# EAGLE design XBee4 (EAGLE 6.4)
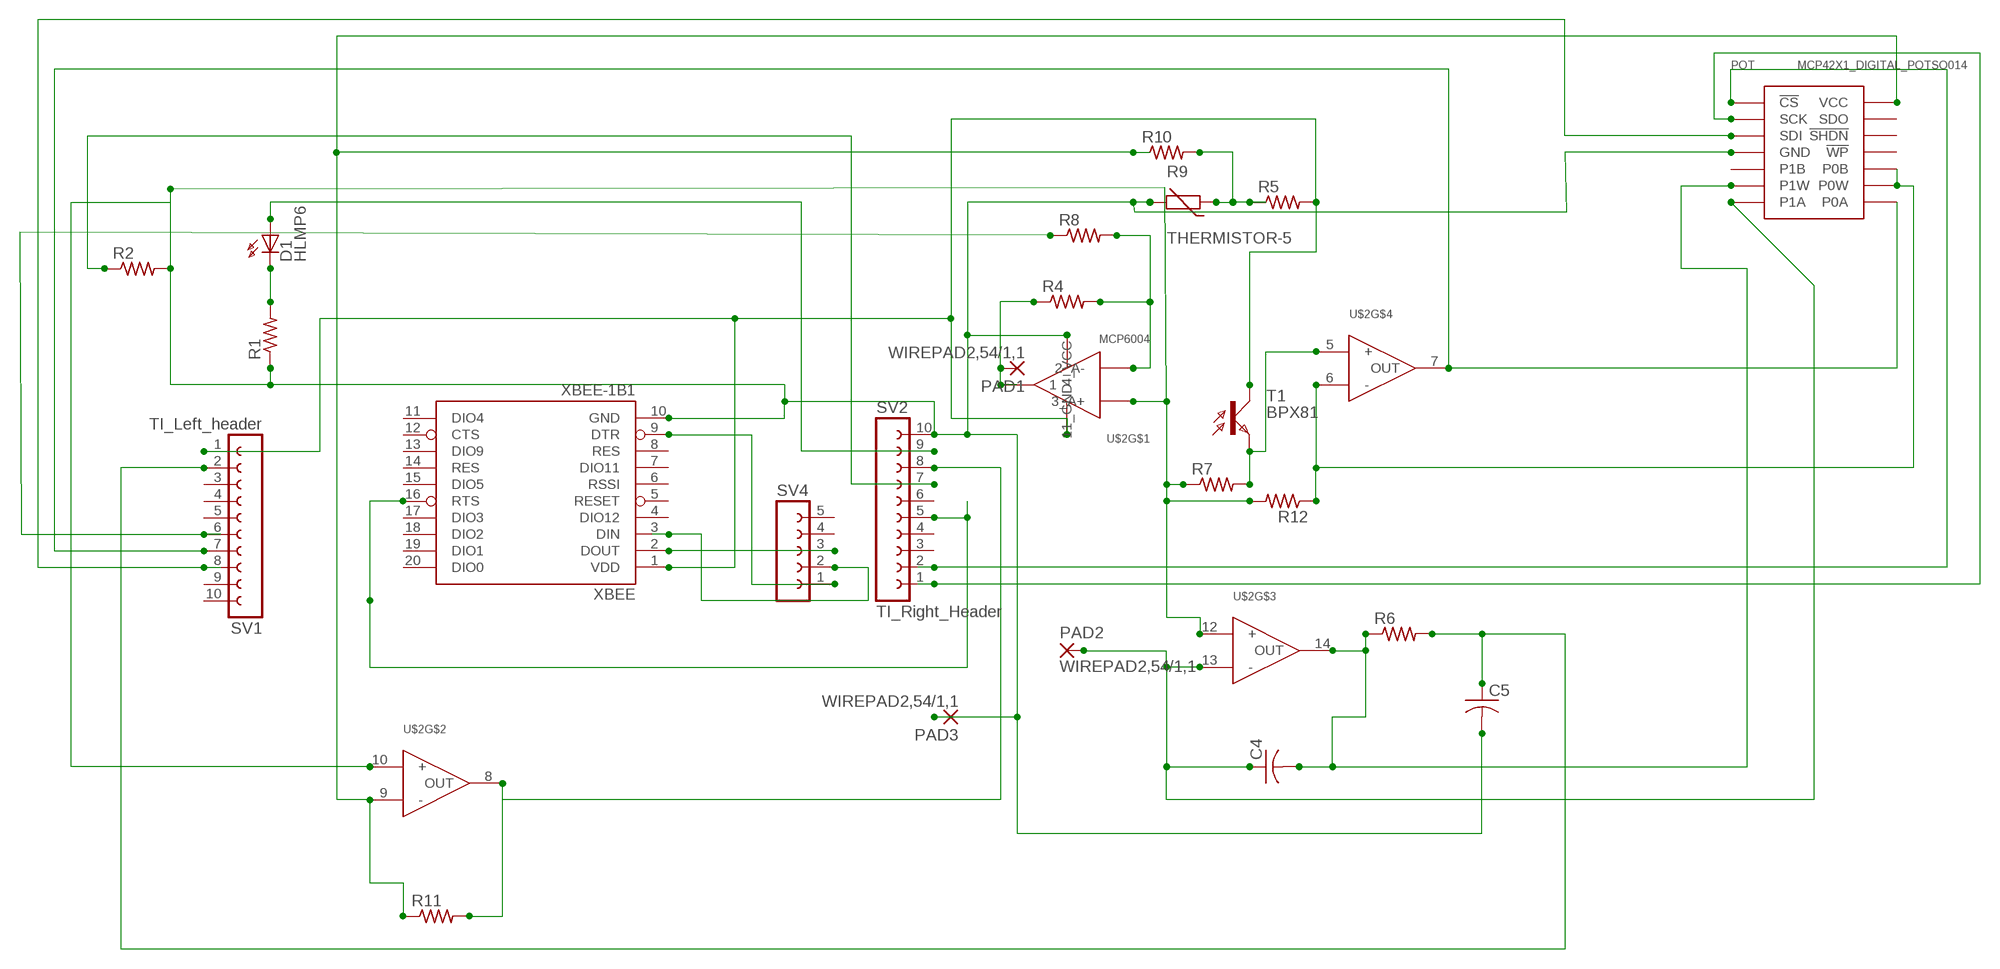
[diagram p0: schematic, sheet 1]

## Parts
C4  C-USC0603  [C0603]
C5  C-USC0603  [C0603]
D1  HLMP6  [HLMP6]
PAD1  WIREPAD2,54/1,1  [2,54/1,1]
PAD2  WIREPAD2,54/1,1  [2,54/1,1]
PAD3  WIREPAD2,54/1,1  [2,54/1,1]
POT  MCP42X1_DIGITAL_POTSO014  [SO014]
R1  R-US_R0603  [R0603]
R2  R-US_R0603  [R0603]
R4  R-US_R0603  [R0603]
R5  R-US_R0603  [R0603]
R6  R-US_R0603  [R0603]
R7  R-US_R0603  [R0603]
R8  R-US_R0603  [R0603]
R9  THERMISTOR-5  [R-5]
R10  R-US_R0603  [R0603]
R11  R-US_R0603  [R0603]
R12  R-US_R0603  [R0603]
SV1  TI_Left_header  FE10-1  [FE10]
SV2  TI_Right_Header  FE10-1  [FE10]
SV4  FE05-1  [FE05-1]
T1  BPX81  [BPX81]
U$2  MCP6004  [SO014]
XBEE  XBEE-1B1  [XBEE-1]

## Nets
GND: C5.2 PAD3.1(P) POT.P4(GND) R1.1 R2.2 R7.1 R9.2 R12.2 SV2.10 U$2.3(3_A+) U$2.10(+) U$2.11(11_GND) U$2.12(+) XBEE.10(GND)
N$1: D1.K R1.2
N$2: R7.2 T1.E U$2.5(+)
N$3: SV4.3 XBEE.2(DOUT)
N$4: SV4.1 XBEE.9(DTR)
N$5: SV4.2 XBEE.3(DIN)
N$7: POT.P9(P0W) POT.P10(P0B) R12.1 U$2.6(-)
N$11: R2.1 SV2.7
N$12: R11.2 SV2.8 U$2.8(OUT)
N$13: POT.P14(VCC) R10.1 R11.1 U$2.9(-)
N$14: PAD1.1(P) R4.1 U$2.1
N$15: D1.A SV2.9
N$17: C4.1 PAD2.1(P) POT.P7(P1A) U$2.13(-)
N$18: C4.2 POT.P6(P1W) R6.1 U$2.14(OUT)
N$19: C5.1 R6.2 SV1.2
N$20: R5.1 R9.1 R10.2
N$21: R4.2 R8.2 U$2.2(2_A-)
N$22: SV2.5 XBEE.16(RTS)
POT_CS: POT.P1(!CS) SV2.2
POT_SCK: POT.P2(SCK) SV2.1
POT_SDI: POT.P3(SDI) SV1.8
PULSE: R8.1 SV1.6
TI_PN7_READ: POT.P8(P0A) SV1.7 U$2.7(OUT)
VCC: R5.2 SV1.1 T1.C U$2.4(4_VCC) XBEE.1(VDD)
Unconnected: POT.P5(P1B) POT.P11(!WP) POT.P12(!SHDN) POT.P13(SDO) SV1.3 SV1.4 SV1.5 SV1.9 SV1.10 SV2.3 SV2.4 SV2.6 SV4.4 SV4.5 XBEE.4(DIO12) XBEE.5(RESET) XBEE.6(RSSI) XBEE.7(DIO11) XBEE.8(RES) XBEE.11(DIO4) XBEE.12(CTS) XBEE.13(DIO9) XBEE.14(RES) XBEE.15(DIO5) XBEE.17(DIO3) XBEE.18(DIO2) XBEE.19(DIO1) XBEE.20(DIO0)

## Library data of the parts
C4 C5 = rcl:C-US: CAPACITOR, American symbol
D1 = display-hp:HLMP6: LED 2mm horizontal; MF: AGILENT TECHNOLOGIES; MPN: HLMP-6500; OC_FARNELL: 1652490; OC_NEWARK: 40K0088
PAD1-PAD3 = wirepad:WIREPAD: Wire PAD connect wire on PCB
POT = JackLibrary:MCP42X1_DIGITAL_POT
R1 R2 R4-R8 R10-R12 = resistor:R-US_: RESISTOR, American symbol
R9 = varistor:THERMISTOR: THERMISTOR
SV1 SV2 = con-lsta:FE10-1: FEMALE HEADER; OC_FARNELL: unknown; OC_NEWARK: unknown
SV4 = con-lsta:FE05-1: FEMALE HEADER; OC_FARNELL: unknown; OC_NEWARK: unknown
T1 = opto-trans-siemens:BPX81: PHOTO TRANSISTOR; OC_FARNELL: unknown; OC_NEWARK: unknown
U$2 = SparkFun-AnalogIC:MCP6004: 14SOIC quad op amp, R2R, low power
XBEE = SparkFun-RF:XBEE-1: Xbee module footprints SMT header is CONN-09042.

## Board
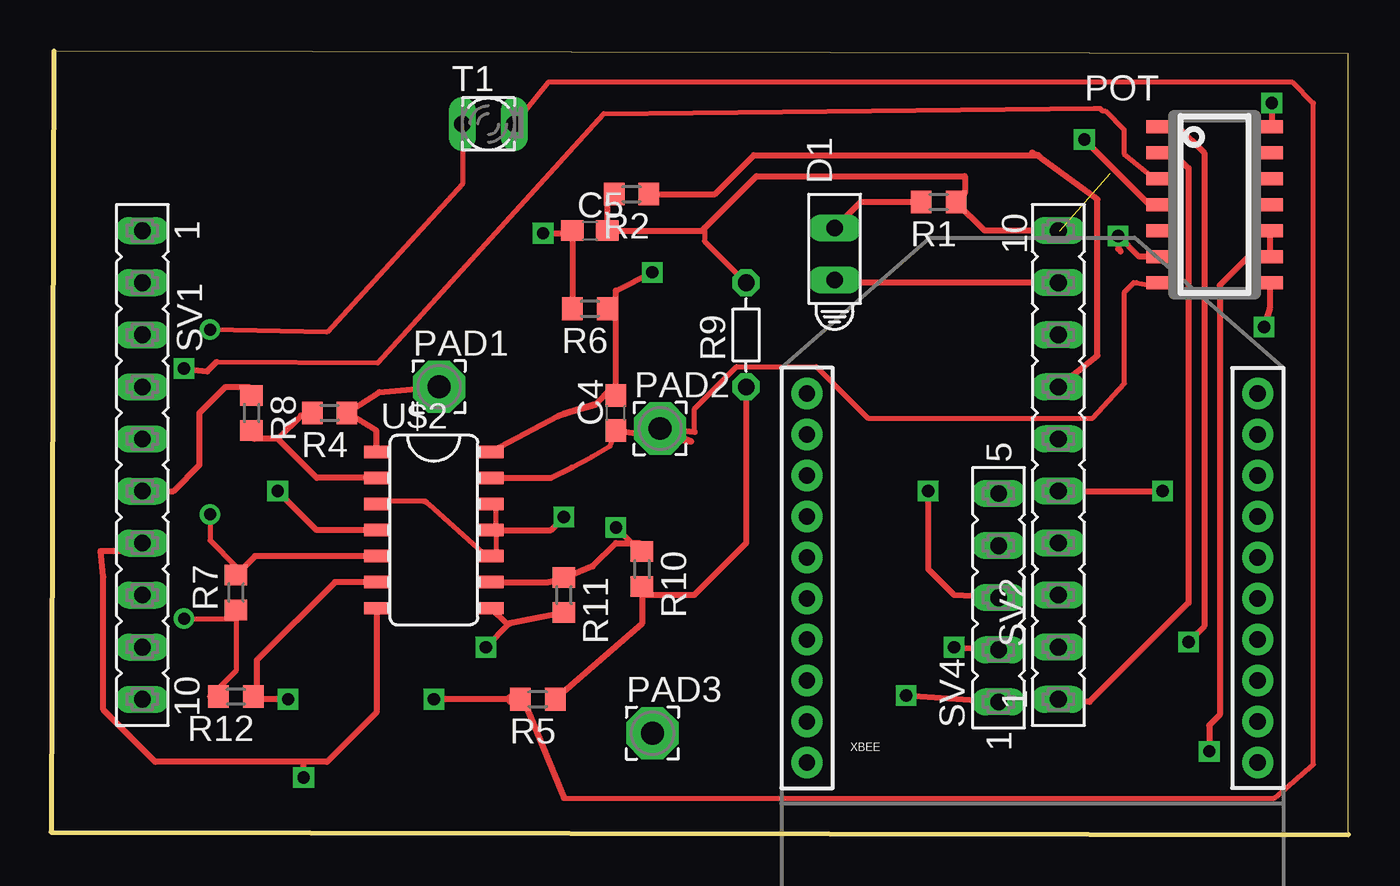
[diagram p1: board, top side]
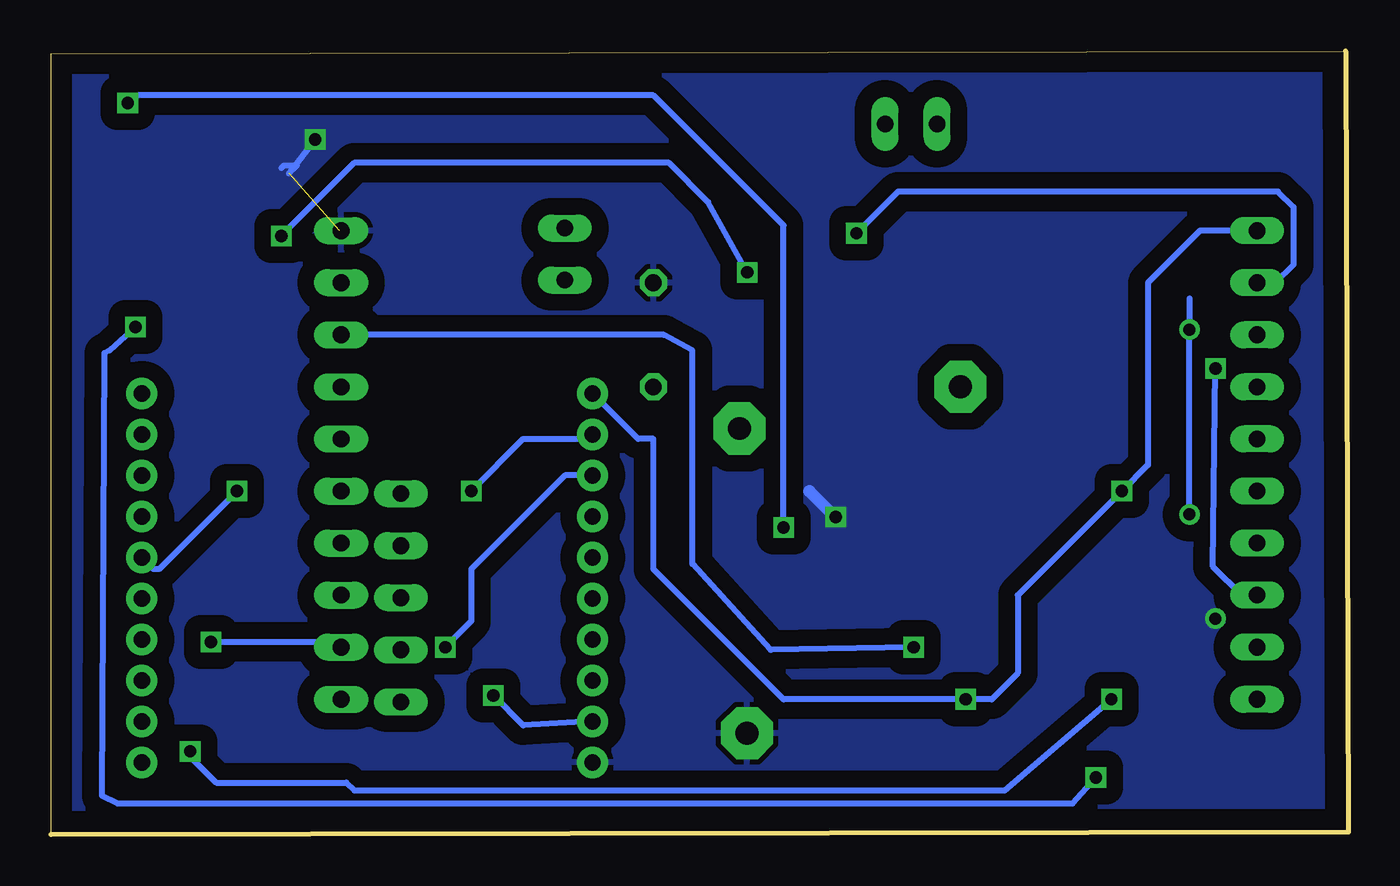
[diagram p2: board, bottom side, seen from below]

Size 63.3 x 38.22 mm. Coordinates in mm from the lower left corner, seen from the top.
Outline: 63.3,0 63.3,38.09 0.13,38.22 0,0.13 63.3,0
Copper layers (1*16): Top 0.035mm / dielectric 1.5mm / Bottom 0.035mm
Design rules "default *": minimum track width 10mil, minimum drill 23mil, track to track 8mil, track to pad 8mil, pad to pad 8mil, via to via 8mil, smd to smd 8mil, copper to edge 40mil, drill to drill 8mil, minimum pad ring 10mil, minimum via ring 8mil, stop-mask expansion 4mil, vias tented up to drill 0mil, thermal gap 10mil

### Footprints (pad centres in the part's own frame; a part is rotated, then mirrored left to right if it is on the bottom)
C0603 = smd 1.1 x 1: 1 -0.85,0; 2 0.85,0
HLMP6 = drill 0.813 long: A -1.27,0; K 1.27,0
2,54/1,1 = drill 1.118 pad 2.54 octagon: 1 0,0
SO014 = smd 1.27 x 0.635: P1 -2.692,3.81; P2 -2.692,2.54; P3 -2.692,1.27; P4 -2.692,0; P5 -2.692,-1.27; P6 -2.692,-2.54; P7 -2.692,-3.81; P8 2.692,-3.81; P9 2.692,-2.54; P10 2.692,-1.27; P11 2.692,0; P12 2.692,1.27; P13 2.692,2.54; P14 2.692,3.81
R0603 = smd 1 x 1.1: 1 -0.85,0; 2 0.85,0
R-5 = drill 0.813 octagon: 1 -2.54,0; 2 2.54,0
FE10 = drill 0.813 long: 1 -11.43,0; 2 -8.89,0; 3 -6.35,0; 4 -3.81,0; 5 -1.27,0; 6 1.27,0; 7 3.81,0; 8 6.35,0; 9 8.89,0; 10 11.43,0
FE05-1 = drill 0.813 long: 1 -5.08,0; 2 -2.54,0; 3 0,0; 4 2.54,0; 5 5.08,0
BPX81 = drill 0.813 long: C 1.27,0; E -1.27,0
SO014' = smd 0.6 x 1.2: 1 -3.175,-2.8; 2 -1.905,-2.8; 3 -0.635,-2.8; 4 0.635,-2.8; 5 1.905,-2.8; 6 3.175,-2.8; 7 4.445,-2.8; 8 4.445,2.8; 9 3.175,2.8; 10 1.905,2.8; 11 0.635,2.8; 12 -0.635,2.8; 13 -1.905,2.8; 14 -3.175,2.8
XBEE-1 = drill 0.8 pad 1.524: 1 -11,20; 2 -11,18; 3 -11,16; 4 -11,14; 5 -11,12; 6 -11,10; 7 -11,8; 8 -11,6; 9 -11,4; 10 -11,2; 11 11,2; 12 11,4; 13 11,6; 14 11,8; 15 11,10; 16 11,12; 17 11,14; 18 11,16; 19 11,18; 20 11,20

### Placement (x,y rotation side)
C4  27.56,20.57 90 top
C5  26.29,29.46 0 top
D1  38.23,28.32 90 top
PAD1  18.92,21.84 0 top
PAD2  29.72,19.81 0 top
PAD3  29.34,4.95 0 top
POT  56.77,30.73 0 top
R1  43.31,30.86 180 top
R2  28.32,31.24 180 top
R4  13.59,20.57 180 top
R5  23.75,6.6 180 top
R6  26.29,25.65 180 top
R7  9.02,11.81 90 top
R8  9.78,20.57 270 top
R9  33.91,24.38 90 top
R10  28.83,12.95 270 top
R11  25.02,11.68 270 top
R12  9.02,6.73 180 top
SV1  4.45,18.03 270 top
SV2  49.15,18.03 90 top
SV4  46.23,11.56 90 top
T1  21.34,34.67 0 top
U$2  MCP6004  [SO014']  18.67,15.49 270 top
XBEE  47.88,1.52 0 top

### Tracks (layer width: path | path; a pad name or v marks a point on that pad's centre or on a via)
GND  (via drill 0.58, 0.6)  (1 unrouted)
  Top 0.254: 54.03,30.61 POT.P4 | 49.23,29.46 SV2.10 | 18.41,16.13 21.08,13.72 U$2.10 21.72,13.72 21.72,14.99 | 18.41,16.13 18.16,16.26 | 18.16,16.26 18.29,16.26 18.41,16.13 | 18.16,16.26 16,16.26 U$2.3 | 21.72,14.99 21.72,16.26 U$2.12 | 21.72,14.99 U$2.11 | 7.75,6.73 9.02,8 R7.1 9.02,10.54 v6.48,10.54 | R9.2 31.88,28.96 31.88,29.59
  Top 0.305: U$2.11 24.38,14.86 v25.02,15.49 | 7.75,6.73 R12.2 | SV2.10 45.55,29.46 R1.1 44.58,31.28 44.58,32.13 34.42,32.13 31.88,29.59 31.75,29.46 C5.2 27.14,30.91 R2.2 | 54.03,30.61 53.72,30.61 v50.42,33.91
  Bottom 0.254: v6.48,10.54 6.7,10.21
  Bottom 0.305: v50.42,33.91 51.69,32.26 51.31,32.64 51.94,32.64 52.07,32.51
  Bottom 0.61: v25.02,15.49 26.29,16.76
  pour Bottom (isolate 0.813): 1.14,1.14 0.63,37.72 62.74,37.47 62.36,0.63
N$1
  Top 0.305: R1.2 39.5,30.86 D1.K
N$2  (via drill 0.58)
  Top 0.254: v7.75,15.62 7.75,14.35 9.02,13.08 R7.2 | v7.75,24.64 13.46,24.51 20.07,31.75 T1.E
  Top 0.305: U$2.5 9.95,13.59 R7.2
  Bottom 0.305: v7.75,15.62 v7.75,24.64 7.75,26.16
N$3  (via drill 0.6)
  Top 0.305: SV4.3 44.07,11.68 42.8,12.95 v42.8,16.76
  Bottom 0.305: v42.8,16.76 40.26,19.3 37.1,19.3 XBEE.2
N$4  (via drill 0.6)
  Top 0.305: v41.72,6.79 SV4.1
  Bottom 0.305: XBEE.9 40.26,5.33 v41.72,6.79
N$5  (via drill 0.6)
  Top 0.305: v44.07,9.14 SV4.2
  Bottom 0.305: XBEE.3 38.23,17.52 42.8,12.95 42.8,10.41 v44.07,9.14
N$7  (via drill 0.6)
  Top 0.305: U$2.6 13.84,12.32 10.03,8.51 10.03,6.9 R12.1 9.99,6.6 v11.56,6.6 | POT.P10 POT.P9 58.42,28.19 57.02,26.8 57.02,5.84 56.51,5.33 v56.51,4.06
  Bottom 0.305: v11.56,6.6 16.76,2.16 48.51,2.16 48.9,2.54 55.24,2.54 56.51,3.81 v56.51,4.06
N$11
  Top 0.305: SV2.7 51.05,23.37 51.05,30.99 48.35,32.96 | 48.35,32.96 47.88,33.27 | R2.1 32.38,31.24 34.29,33.15 48.16,33.15 48.35,32.96
N$12  (via drill 0.6)
  Top 0.305: U$2.8 22.23,10.28 R11.2 22.35,10.28 v21.21,9.14
  Bottom 0.305: v21.21,9.14 28.19,9.02 32,13.21 32,23.62 33.4,24.38 SV2.8
N$13  (via drill 0.6)
  Top 0.305: U$2.9 24.25,12.32 R11.1 26.37,13.08 26.42,13.08 27.56,14.22 28.32,14.22 | R10.1 28.7,14.22 28.32,14.22 | 28.32,14.22 v27.56,14.99 | v59.56,35.69 59.56,34.65 POT.P14
  Bottom 0.305: v27.56,14.99 27.56,29.72 33.91,36.07 59.05,36.07 v59.56,35.69
N$14
  Top 0.305: U$2.1 15.87,19.69 R4.1 16,21.59 PAD1.1
N$15
  Top 0.305: SV2.9 38.35,26.92 D1.A
N$17
  Top 0.254: 31.39,19.63 31.39,20.78 33.45,22.84 37.34,22.84 39.85,20.32 50.83,20.32 52.37,22 52.37,26.47 52.83,26.92 52.96,26.92 54.03,26.72 POT.P7 | 25.4,17.91 26.37,18.41 27.28,18.95 C4.1
  Top 0.305: C4.1 31.24,19.17 PAD2.1 31.39,19.63 | U$2.13 24.38,17.4 25.4,17.91
N$18  (via drill 0.6)
  Top 0.254: 27.56,25.52 27.51,25.58 R6.1 | 27.28,21.69 C4.2
  Top 0.305: C4.2 27.56,25.52 27.56,26.54 v29.34,27.43 | 26.54,20.95 25.66,20.7 24.73,20.41 | 24.73,20.41 U$2.14 | 27.28,21.69 26.62,21.03 24.99,20.52 24.73,20.41 | 52.2,28.45 52.07,28.58 v52.07,29.21 53.09,28.19 POT.P6
  Bottom 0.305: v29.34,27.43 31.24,30.86 33.15,32.77 48.51,32.77 v52.07,29.21
N$19  (via drill 0.6)
  Top 0.305: R6.2 C5.1 25.31,29.34 v24,29.34
  Bottom 0.305: SV1.2 3.56,26.92 2.67,27.81 2.67,30.61 3.43,31.37 21.97,31.37 v24,29.34
N$20
  Top 0.305: R9.1 33.91,14.22 31.37,11.68 28.96,11.68 R10.2 28.83,10.28 R5.1
N$21
  Top 0.305: U$2.2 12.95,17.4 11.05,19.3 | 11.05,19.3 9.91,19.3 R8.2 | R4.2 12.19,20.44 11.05,19.3
N$22  (via drill 0.6)
  Top 0.305: SV2.5 v54.23,16.76
  Bottom 0.305: v54.23,16.76 58.04,12.95 58.31,12.95 XBEE.16
POT_CS  (via drill 0.6)
  Top 0.305: POT.P1 54.99,34.54 56.26,33.27 56.26,10.16 v55.5,9.4
  Bottom 0.305: v55.5,9.4 49.4,9.4 SV2.2
POT_SCK
  Top 0.305: POT.P2 54.74,33.27 55.5,32.51 55.5,11.3 50.67,6.48 49.28,6.48 SV2.1
POT_SDI  (via drill 0.6)
  Top 0.254: 8.08,23.06 15.95,23.01 26.98,35.18 50.9,35.43 51.18,35.43 51.31,35.31 51.43,35.31 52.35,34.39 52.35,33.22 53.77,32.08 POT.P3
  Top 0.305: v6.48,22.73 7.62,22.61 8.08,23.06
  Bottom 0.305: SV1.8 5.21,11.68 6.6,13.08 v6.48,22.73
PULSE
  Top 0.305: SV1.6 5.97,16.76 7.24,18.03 7.24,20.57 8.51,21.84 9.65,21.84 R8.1
TI_PN7_READ  (via drill 0.6)
  Top 0.305: U$2.7 15.87,5.96 13.46,3.56 12.32,3.56 | 12.32,3.56 5.08,3.56 2.54,6.1 2.54,12.57 2.41,13.84 4.06,13.84 SV1.7 | POT.P8 59.46,25.68 v59.18,24.77 | v12.32,2.79 12.32,3.56
  Bottom 0.305: v59.18,24.77 60.45,23.62 60.71,23.49 60.83,1.91 60.07,1.52 13.46,1.52 v12.32,2.79
VCC  (via drill 0.6)
  Top 0.254: T1.C 24.26,36.7 60.58,36.7 61.6,35.69 61.6,3.43 59.69,1.78 25.02,1.78
  Top 0.305: v18.67,6.6 R5.2 22.99,6.73 25.02,1.78 | U$2.4 12.95,14.86 v11.05,16.76
  Top 0.61: R5.2 22.48,6.6
  Bottom 0.305: XBEE.1 34.66,19.3 33.91,19.3 33.91,12.95 27.56,6.6 v18.67,6.6 17.4,6.6 16.13,7.87 16.13,11.68 v11.05,16.76 9.78,18.03 9.78,26.92 7.24,29.46 SV1.1